# Altium schematic sheet Power_Supply.SchDoc
size A4; MPS_Contact: www.monolithicpower.com
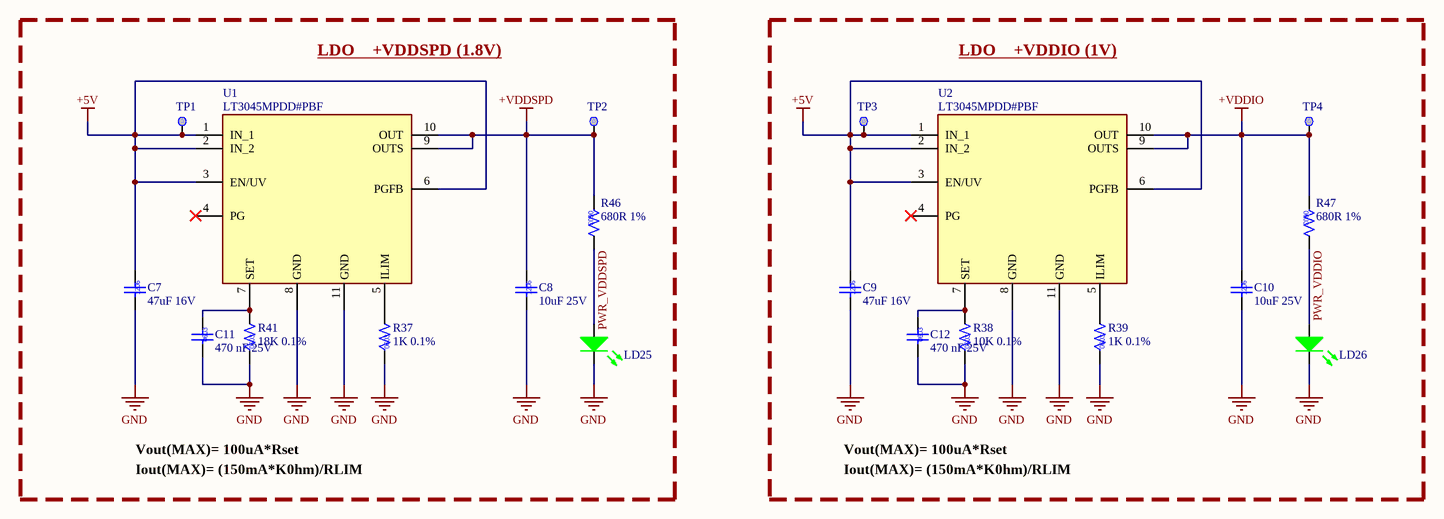
[diagram p0: Power_Supply.SchDoc]

## Parts
C7  47uF 16V  [CC/NM 1206]
C8  10uF 25V  [CC/NM 1206]
C9  47uF 16V  [CC/NM 1206]
C10  10uF 25V  [CC/NM 1206]
C11  470 nF 25V  [CC/NM 0603]
C12  470 nF 25V  [CC/NM 0603]
LD25  APHD1608LCGCK  [LED/0603/GREEN]  (value not drawn)
LD26  APHD1608LCGCK  [LED/0603/GREEN]  (value not drawn)
R37  1K 0.1%  [CC/NM 0603]
R38  10K 0.1%  [CC/NM 0603]
R39  1K 0.1%  [CC/NM 0603]
R41  18K 0.1%  [CC/NM 0603]
R46  680R 1%  [CC/NM 0603]
R47  680R 1%  [CC/NM 0603]
TP1  Test Point  [TP_SMD_1MM]  (value not drawn)  (no BOM)
TP2  Test Point  [TP_SMD_1MM]  (value not drawn)  (no BOM)
TP3  Test Point  [TP_SMD_1MM]  (value not drawn)  (no BOM)
TP4  Test Point  [TP_SMD_1MM]  (value not drawn)  (no BOM)
U1  LT3045MPDD#PBF  [SON50P300X300X80-11N]
U2  LT3045MPDD#PBF  [SON50P300X300X80-11N]

## Blocks framed on the sheet
LDO    +VDDSPD (1.8V): C7 C8 C11 LD25 R37 R41 R46 TP1 TP2 U1
LDO    +VDDIO (1V): C9 C10 C12 LD26 R38 R39 R47 TP3 TP4 U2

## Nets
+5V: C7.2 C9.2 TP1.1 TP3.1 U1.1(IN_1) U1.2(IN_2) U1.3(EN/UV) U1.6(PGFB) U2.1(IN_1) U2.2(IN_2) U2.3(EN/UV) U2.6(PGFB)
+VDDIO: C10.2 R47.1 TP4.1 U2.9(OUTS) U2.10(OUT)
+VDDSPD: C8.2 R46.1 TP2.1 U1.9(OUTS) U1.10(OUT)
GND: C7.1 C8.1 C9.1 C10.1 C11.1 C12.1 LD25.2(K) LD26.2(K) R37.1 R38.1 R39.1 R41.1 U1.8(GND) U1.11(GND) U2.8(GND) U2.11(GND)
PWR_VDDIO: LD26.1(A) R47.2
PWR_VDDSPD: LD25.1(A) R46.2
NetC11_2: C11.2 R41.2 U1.7(SET)
NetC12_2: C12.2 R38.2 U2.7(SET)
NetR37_2: R37.2 U1.5(ILIM)
NetR39_2: R39.2 U2.5(ILIM)

Not connected (* = marked no-connect by the designer): U1 4(PG)*; U2 4(PG)*

## Notes on the sheet
- Vout(MAX)= 100uA*Rset
- Iout(MAX)= (150mA*K0hm)/RLIM
- Engineer:
- Designed for:
- File Name:
- Project Name:
- Mod. Date:
- Sheet:
- Drawn By:
- Ref:
- of
- Rev:
- Contact:
- Monolithic Power Systems

## Library data of the parts
C7 C9 = 1206YD476MAT2A: Condensadores de cerámica multicapa (MLCC- SMD/SMT) KGM31HR51C476MU NEW GLOBAL PN 16V 47uF X A 581-KGM31HR51C476MU; Manufacturer: KYOCERA AVX; DrownBy: Xavier Rocher; Package: 1206; Supplier 1: Digikey; Supplier  Part Number 1: 4155127; Supplier 2: Mouser; Supplier  Part Number 2: 581-1206YD476MAT2A; Manufacturer Part Number: 1206YD476MAT2A; Automotive: https://datasheets.kyocera-avx.com/cx5r-KGM.pdf; Value: 47uF 16V
C8 C10 = CGA5L1X7R1E106K160AC: Condensadores de cerámica multicapa (MLCC- SMD/SMT) CGA 1206 25V 10uF X7R 10% AEC-Q200; Manufacturer: TDK; DrownBy: Xavier Rocher; Package: 1206; Supplier 1: Digikey; Supplier  Part Number 1: 2458327; Supplier 2: Mouser; Supplier  Part Number 2: 810-CGA5L1X7R1E106K; Manufacturer Part Number: CGA5L1X7R1E106K160AC; Automotive: https://www.farnell.com/datasheets/4520416.pdf?_gl=1*1qw350c*_gcl_aw*R0NMLjE3NzI0NTg0MDAuQ2p3S0NBaUFoNVhOQmhBQUVpd0FfQnU4RlFpaGh0aTJCR0F1SXBlQ2pXMWtFYmlZc2JraDRpajgydjZyT2lxVUUtZHBLLW80X0NoNy1Sb0NSZjhRQXZEX0J3RQ..*_gcl_au*MjEwMjY0Mzg0MC4xNzcyNDM5MTYx; Value: 10uF 25V
C11 C12 = C0603X6S0G474M030BC: Condensadores de cerámica multicapa (MLCC- SMD/SMT) 0201 4VDC 0.47uF 20% X6S 0.3mm; Manufacturer: TDK; DrownBy: Xavier Rocher; Datasheet: https://product.tdk.com/system/files/dam/doc/product/capacitor/ceramic/mlcc/catalog/mlcc_commercial_general_en.pdf; Package: 0603; Supplier 1: Digikey; Supplier  Part Number 1: 4171987; Supplier 2: Mouser; Supplier  Part Number 2: 810-C0603X6S0G474MBC; Manufacturer Part Number: C0603X6S0G474M030BC; Value: 470 nF 25V
LD25 LD26 = APHD1608LCGCK: Green Light Emitting Diode; Manufacturer: Kingbright; DrownBy: Xavier Rocher; Datasheet: https://www.kingbrightusa.com/images/catalog/SPEC/APHD1608LCGCK.pdf; Package: 0603; Supplier 1: Digikey; Supplier  Part Number 1: 754-2031-2-ND; Supplier 2: Mouser; Supplier  Part Number 2: 604-APHD1608LCGCK; Manufacturer Part Number: APHD1608LCGCK; Automotive: No; Value: APHD1608LCGCK
R37 R39 = TNPW06031K00BYCN: Resistores de película fina - SMD TNPW-0603 1K 0.1% T-13 R52; Manufacturer: Vishay; DrownBy: Xavier Rocher; Datasheet: https://4donline.ihs.com/images/VipMasterIC/IC/VISH/VISH-S-A0025054536/VISH-S-A0025054537-1.pdf?hkey=6D3A4C79FDBF58556ACFDE234799DDF0; Package: 0603; Supplier 1: Digikey; Supplier  Part Number 1: TNPW06031K00BYCN-ND; Supplier 2: Mouser; Supplier  Part Number 2: 71-TNPW060318K0BYCN; Manufacturer Part Number: TNPW06031K00BYCN; Automotive: Yes; Value: 1K 0.1%
R38 = CRT0603-BY-1002ELF: Thin Film Resistors - SMD 1/10watts 10K .1%; Manufacturer: Bourns; DrownBy: Xavier Rocher; Datasheet: https://4donline.ihs.com/images/VipMasterIC/IC/VISH/VISH-S-A0025054536/VISH-S-A0025054537-1.pdf?hkey=6D3A4C79FDBF58556ACFDE234799DDF0; Package: 0603; Supplier 1: Farnell; Supplier  Part Number 1: 2008310; Supplier 2: Mouser; Supplier  Part Number 2: 652-CRT0603BY1002ELF; Manufacturer Part Number: CRT0603-BY-1002ELF; Automotive: Yes; Value: 10K 0.1%
R41 = TNPW060318K0BYCN: Resistencia SMD de Tipo Chip, 20 kohm, ± 0.1%, 125 mW, 0603 [Métrica 1608], Película Delgada; Manufacturer: Vishay; DrownBy: Xavier Rocher; Datasheet: https://4donline.ihs.com/images/VipMasterIC/IC/VISH/VISH-S-A0025054536/VISH-S-A0025054537-1.pdf?hkey=6D3A4C79FDBF58556ACFDE234799DDF0; Package: 0603; Supplier 1: Farnell; Supplier  Part Number 1: 4140054; Supplier 2: Mouser; Supplier  Part Number 2: 71-TNPW060318K0BYCN; Manufacturer Part Number: TNPW060318K0BYCN; Automotive: Yes; Value: 18K 0.1%
R46 R47 = CR0603-FX-6800ELF: Resistores de película gruesa - SMD 680 ohm 1%; Manufacturer: BOURNS; DrownBy: Xavier Rocher; Datasheet: https://eu.mouser.com/datasheet/3/40/1/cr.pdf; Package: 0603; Supplier 1: Farnell; Supplier  Part Number 1: 4014380; Supplier 2: Mouser; Supplier  Part Number 2: 652-CR0603FX-6800ELF; Manufacturer Part Number: CR0603-FX-6800ELF; Automotive: No; Value: 680R 1%
TP1-TP4 = Test_Point_1mm: Test Point 1mm; Internal_Part_Number: MCD-00074; Part_Type: Mechanical; Status: Released; Manufacturer_Part_Number: n/a; Manufacturer: n/a; ComponentLink1Description: Datasheet; ComponentLink1URL: http://na; Provided_By: n/a; ECCN_US: n/a; ECCN_EU: n/a
U1 U2 = LT3045MPDD#PBF: 20V, 500mA, Ultralow Noise, Ultrahigh PSRR Linear Regulator; Manufacturer: Analog Devices; DrownBy: Xavier Rocher; Datasheet: https://www.analog.com/media/en/technical-documentation/data-sheets/lt3045.pdf; Package: DFN-10; Supplier 1: Farnell; Supplier  Part Number 1: 4027559; Supplier 2: Mouser; Supplier  Part Number 2: 584-LT3045MPDD#PBF; Manufacturer Part Number: LT3045MPDD#PBF; Automotive: Yes; Value: LT3045MPDD#PBF